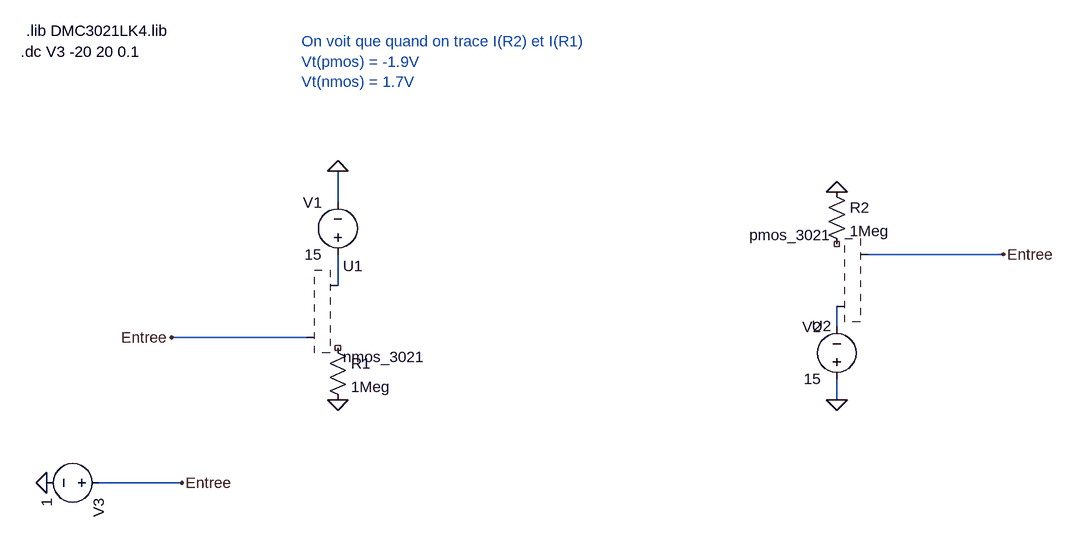
[diagram p0: schematic Test_M1_M2.asc]
Test_M1_M2.asc, the LTspice schematic file:
Version 4
SHEET 1 1276 1036
WIRE 160 112 160 64
WIRE 1184 192 976 192
WIRE 160 240 160 192
WIRE 928 304 928 272
WIRE 112 320 -96 320
WIRE 928 416 928 384
WIRE -80 544 -208 544
FLAG -80 544 Entree
FLAG -96 320 Entree
FLAG 1184 192 Entree
FLAG -288 544 0
FLAG 160 64 0
FLAG 928 416 0
FLAG 160 416 0
FLAG 928 96 0
SYMBOL voltage -192 544 R90
WINDOW 123 0 0 Left 0
WINDOW 39 0 0 Left 0
SYMATTR InstName V3
SYMATTR Value 1
SYMBOL Voltage 160 208 R180
WINDOW 0 24 96 Left 2
WINDOW 3 24 16 Left 2
SYMATTR InstName V1
SYMATTR Value 15
SYMBOL Voltage 928 400 R180
WINDOW 0 24 96 Left 2
WINDOW 3 24 16 Left 2
SYMATTR InstName V2
SYMATTR Value 15
SYMBOL nmos_3021 112 240 R0
SYMATTR InstName U1
SYMBOL pmos_3021 976 272 R180
SYMATTR InstName U2
SYMBOL Res 144 320 R0
SYMATTR InstName R1
SYMATTR Value 1Meg
SYMBOL Res 912 80 R0
SYMATTR InstName R2
SYMATTR Value 1Meg
TEXT -328 -120 Left 2 !.dc V3 -20 20 0.1
TEXT -320 -152 Left 2 !.lib DMC3021LK4.lib
TEXT 104 -136 Left 2 ;On voit que quand on trace I(R2) et I(R1)\nVt(pmos) = -1.9V\nVt(nmos) = 1.7V

The netlist it stands for:
* Test_M1_M2.asc
V3 Entree 0 1
V1 N001 0 15
V2 0 N002 15
* U1: nmos_3021 (symbol nmos_3021 not available, pin order unknown); nets seen at it: Entree, N001
* U2: pmos_3021 (symbol pmos_3021 not available, pin order unknown); nets seen at it: Entree, N002
R1 NC_01 0 1Meg
R2 0 NC_02 1Meg
.dc V3 -20 20 0.1
.lib DMC3021LK4.lib
* On voit que quand on trace I(R2) et I(R1)
* Vt(pmos) = -1.9V
* Vt(nmos) = 1.7V
.backanno
.end